# EasyEDA schematic Ethernet_Roer.json
TITLE: roer component; REV: 1.0; Date: 2022-01-14; Sheet: 1/1; Company: Aquabots
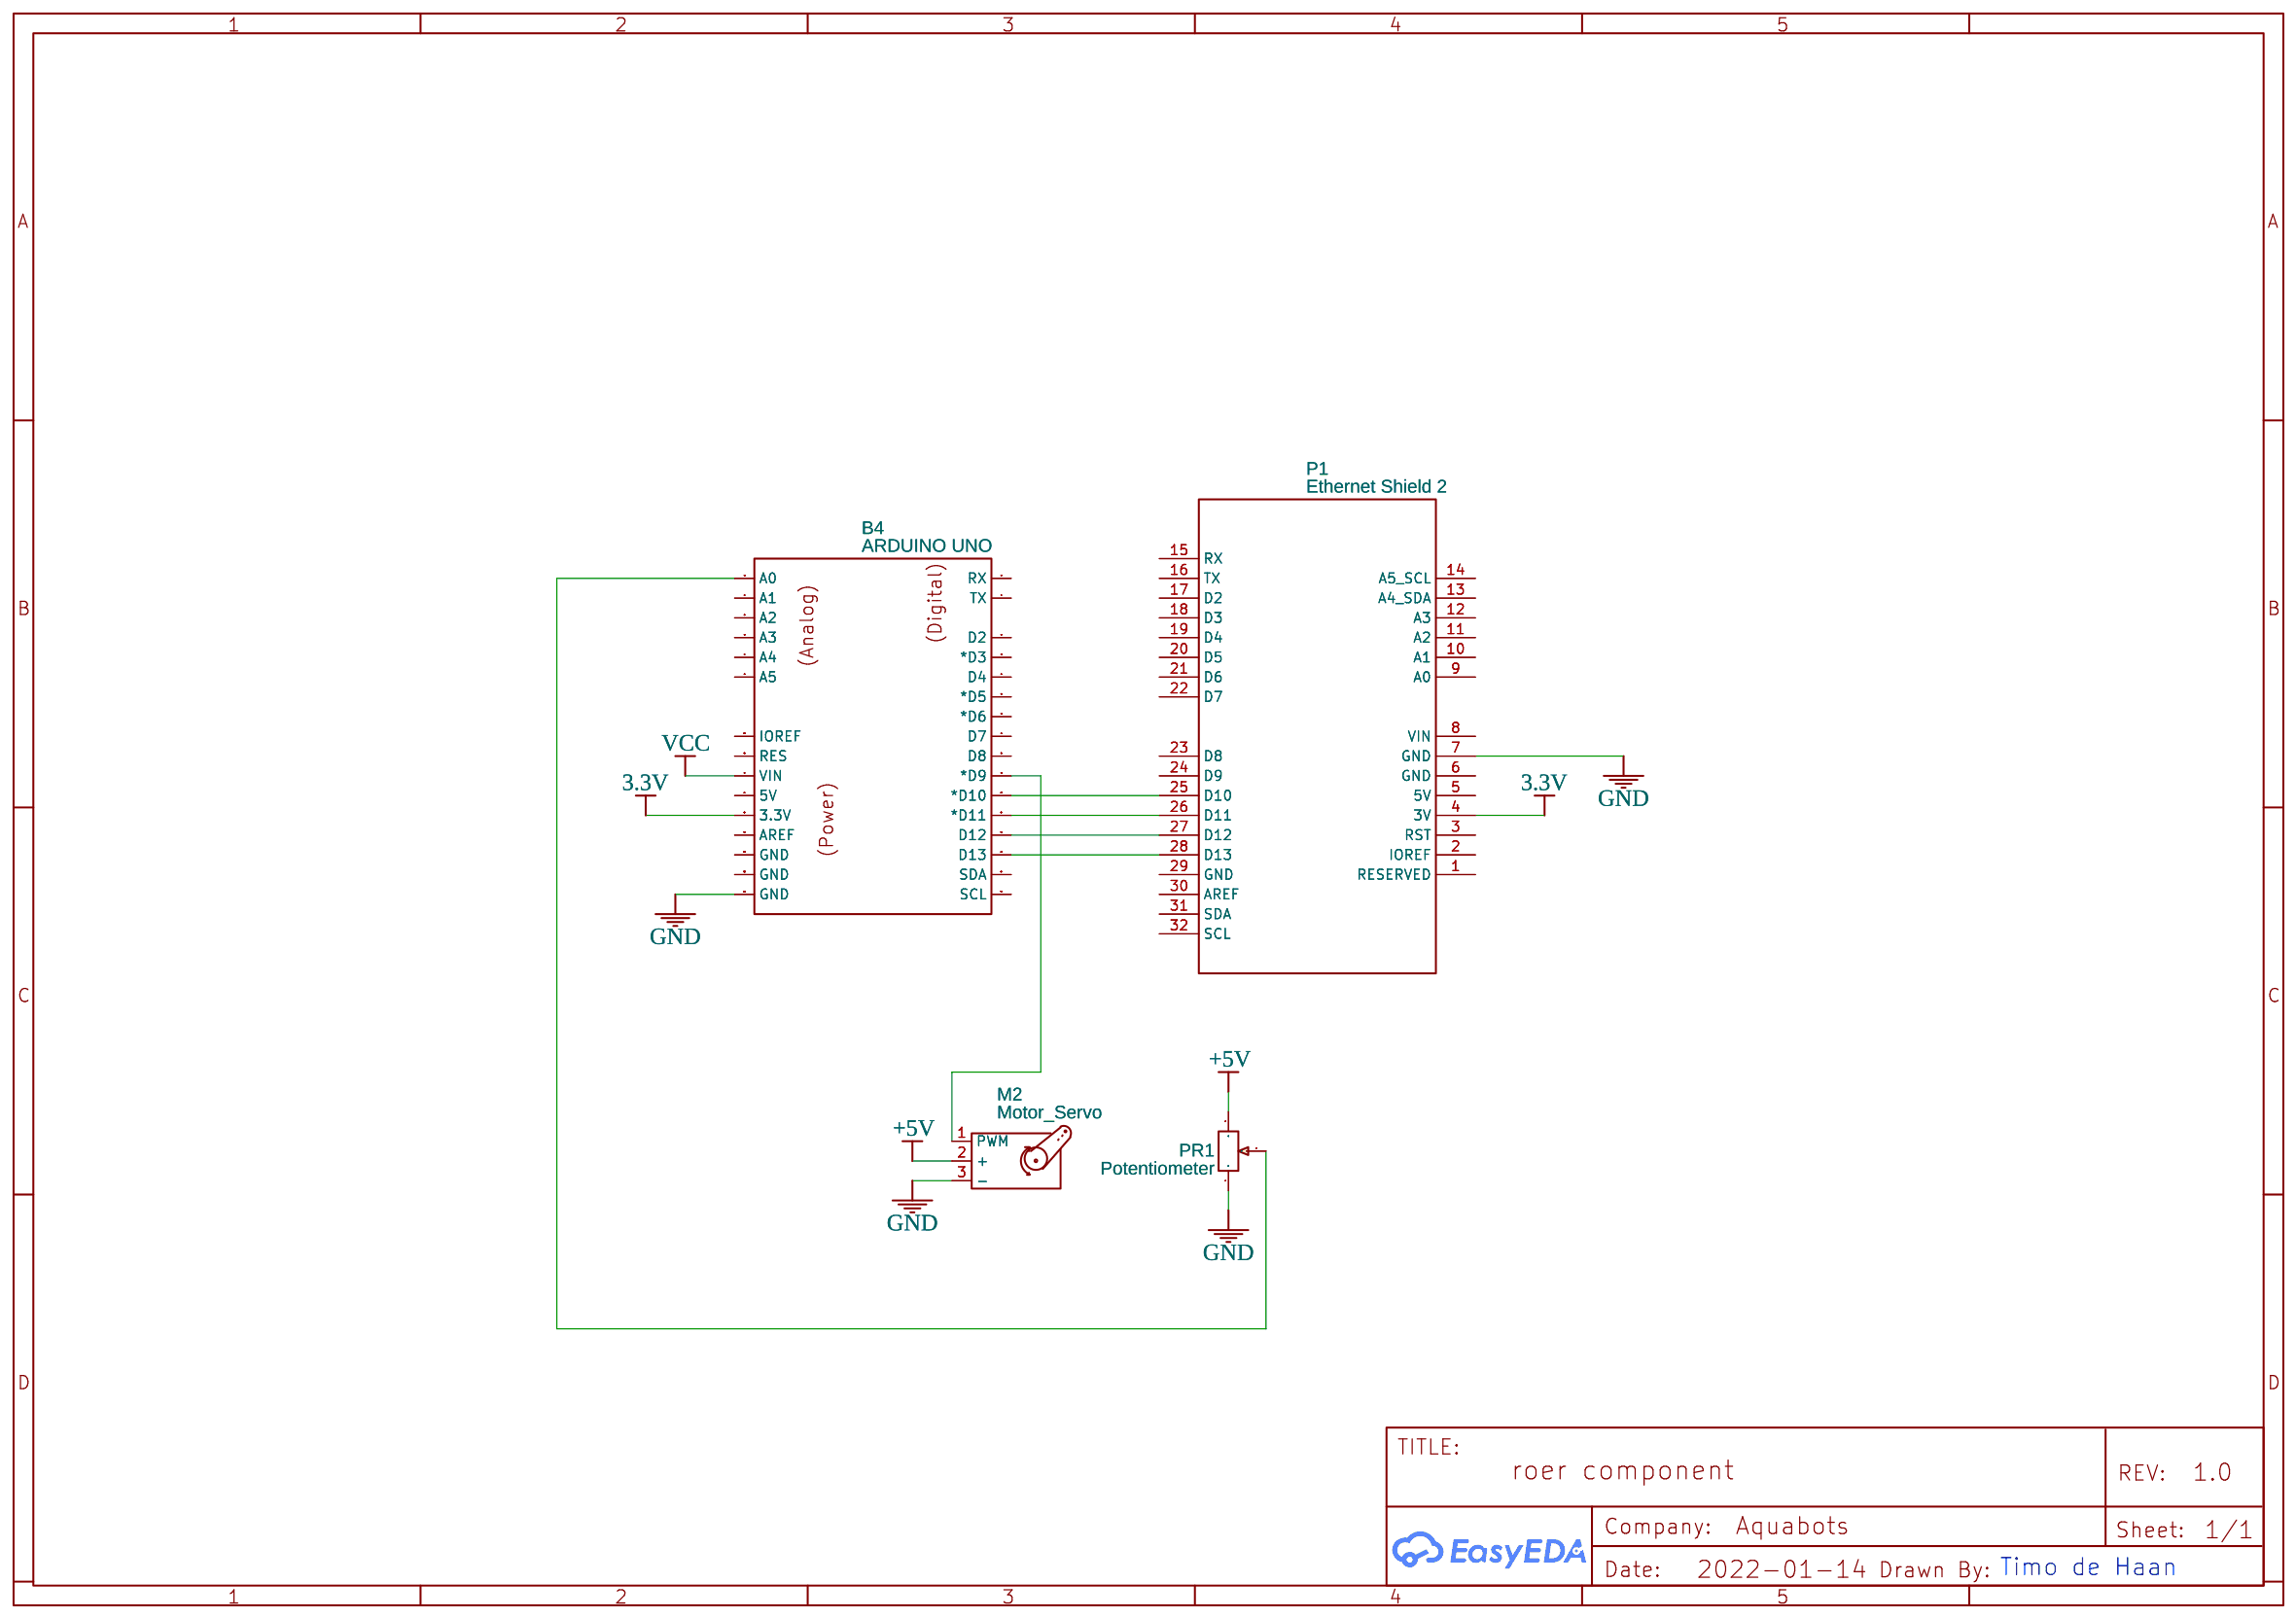
[diagram p0: schematic sheet]

## Parts
B4  ARDUINO UNO  [PKG-ARDUINO-UNO-R3-SHIELD]
M2  Motor_Servo
P1  Ethernet Shield 2  [ETHERNET SHIELD 2]
PR1  Potentiometer  [WH160-1-104]

## Library data of the parts
B4 = ARDUINO UNO R3 SHIELD: Manufacturer: ?; Manufacturer Part: ?; Link: ?; Contributor: Prof. Ing. F. Scordino
M2 = Motor_Servo: Contributor: KiCAD; license: https://www.gnu.org/licenses/lgpl-2.1.html
P1 = Ethernet Shield 2: sourceId: 1T5FDZYC8; Contributor: Montre Med
PR1 = Potentiometer: Tolerance: ±25%; Supplier Part: C61836; Supplier: LCSC; Manufacturer: JML; Manufacturer Part: Potentiometer WH160-1-104

## Nets
3.3V: B4.3.3V P1.4(3V)
+5V: M2.2(+) PR1.3
GND: B4.GND@0(GND) M2.3(-) P1.7(GND) PR1.1
VCC: B4.VIN
Net-(B4-A0): B4.A0 PR1.2
Net-(B4-D9): B4.D9(*D9) M2.1(PWM)
Net-(B4-D10): B4.D10(*D10) P1.25(D10)
Net-(B4-D11): B4.D11(*D11) P1.26(D11)
Net-(B4-D12): B4.D12 P1.27(D12)
Net-(B4-D13): B4.D13 P1.28(D13)

Not connected (* = marked no-connect by the designer): B4 5V A1 A2 A3 A4 A5 AREF D2 D3(*D3) D4 D5(*D5) D6(*D6) D7 D8 GND@1(GND) GND@2(GND) IOREF RES RX SCL SDA TX; P1 1(RESERVED) 2(IOREF) 3(RST) 5(5V) 6(GND) 8(VIN) 9(A0) 10(A1) 11(A2) 12(A3) 13(A4 SDA) 14(A5 SCL) 15(RX) 16(TX) 17(D2) 18(D3) 19(D4) 20(D5) 21(D6) 22(D7) 23(D8) 24(D9) 29(GND) 30(AREF) 31(SDA) 32(SCL)

## Notes on the sheet
- Timo de Haan
